# EAGLE schematic main (EAGLE 9.6.2)
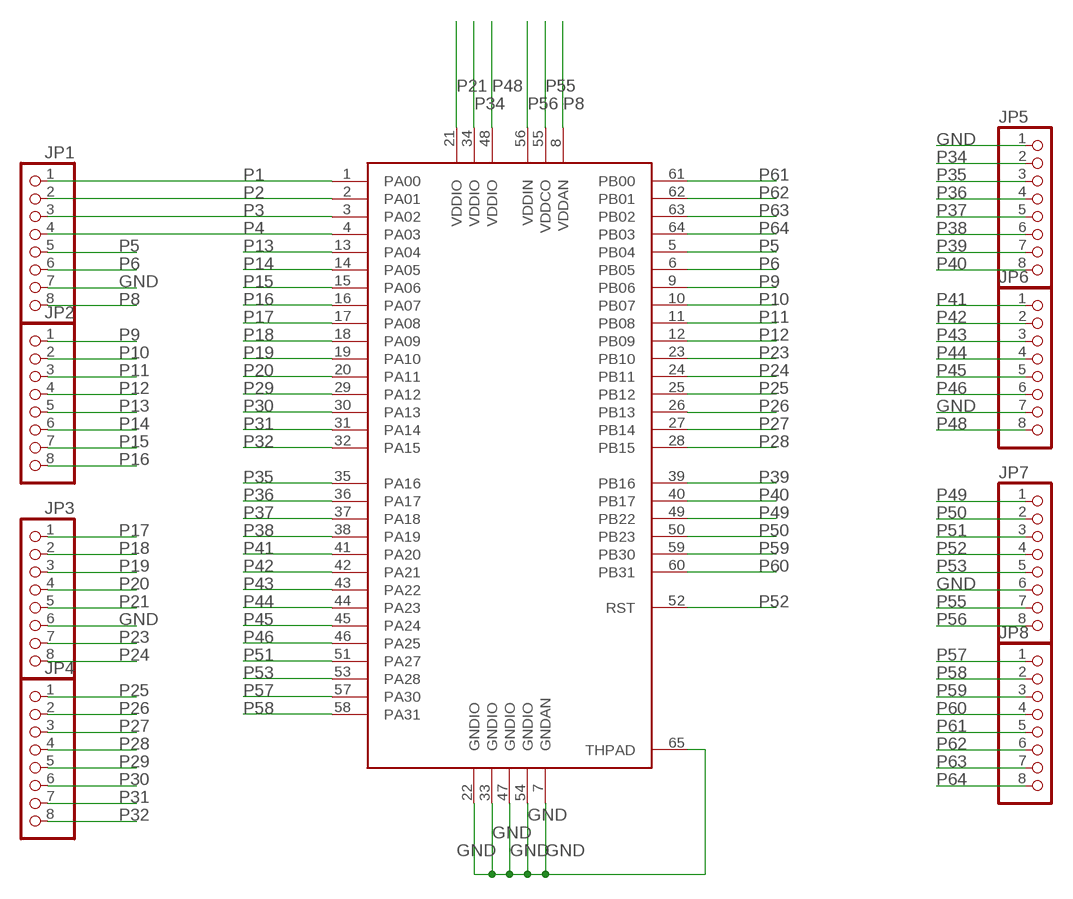
[diagram p0: schematic, sheet 1]

## Parts
JP1  PINHD-1X8CLEANBIG  [1X08-CLEANBIG]
JP2  PINHD-1X8CLEANBIG  [1X08-CLEANBIG]
JP3  PINHD-1X8CLEANBIG  [1X08-CLEANBIG]
JP4  PINHD-1X8CLEANBIG  [1X08-CLEANBIG]
JP5  PINHD-1X8CLEANBIG  [1X08-CLEANBIG]
JP6  PINHD-1X8CLEANBIG  [1X08-CLEANBIG]
JP7  PINHD-1X8CLEANBIG  [1X08-CLEANBIG]
JP8  PINHD-1X8CLEANBIG  [1X08-CLEANBIG]
U$1  ATSAMD21J18AQFN64  [QFN50P900X900X100-65T535]

## Nets
GND: JP1.7 JP3.6 JP5.1 JP6.7 JP7.6 U$1.7(GNDAN) U$1.22(GNDIO) U$1.33(GNDIO) U$1.47(GNDIO) U$1.54(GNDIO) U$1.65(THPAD)
P1: JP1.1 U$1.1(PA00)
P2: JP1.2 U$1.2(PA01)
P3: JP1.3 U$1.3(PA02)
P4: JP1.4 U$1.4(PA03)
P5: JP1.5 U$1.5(PB04)
P6: JP1.6 U$1.6(PB05)
P8: JP1.8 U$1.8(VDDAN)
P9: JP2.1 U$1.9(PB06)
P10: JP2.2 U$1.10(PB07)
P11: JP2.3 U$1.11(PB08)
P12: JP2.4 U$1.12(PB09)
P13: JP2.5 U$1.13(PA04)
P14: JP2.6 U$1.14(PA05)
P15: JP2.7 U$1.15(PA06)
P16: JP2.8 U$1.16(PA07)
P17: JP3.1 U$1.17(PA08)
P18: JP3.2 U$1.18(PA09)
P19: JP3.3 U$1.19(PA10)
P20: JP3.4 U$1.20(PA11)
P21: JP3.5 U$1.21(VDDIO)
P23: JP3.7 U$1.23(PB10)
P24: JP3.8 U$1.24(PB11)
P25: JP4.1 U$1.25(PB12)
P26: JP4.2 U$1.26(PB13)
P27: JP4.3 U$1.27(PB14)
P28: JP4.4 U$1.28(PB15)
P29: JP4.5 U$1.29(PA12)
P30: JP4.6 U$1.30(PA13)
P31: JP4.7 U$1.31(PA14)
P32: JP4.8 U$1.32(PA15)
P34: JP5.2 U$1.34(VDDIO)
P35: JP5.3 U$1.35(PA16)
P36: JP5.4 U$1.36(PA17)
P37: JP5.5 U$1.37(PA18)
P38: JP5.6 U$1.38(PA19)
P39: JP5.7 U$1.39(PB16)
P40: JP5.8 U$1.40(PB17)
P41: JP6.1 U$1.41(PA20)
P42: JP6.2 U$1.42(PA21)
P43: JP6.3 U$1.43(PA22)
P44: JP6.4 U$1.44(PA23)
P45: JP6.5 U$1.45(PA24)
P46: JP6.6 U$1.46(PA25)
P48: JP6.8 U$1.48(VDDIO)
P49: JP7.1 U$1.49(PB22)
P50: JP7.2 U$1.50(PB23)
P51: JP7.3 U$1.51(PA27)
P52: JP7.4 U$1.52(RST)
P53: JP7.5 U$1.53(PA28)
P55: JP7.7 U$1.55(VDDCO)
P56: JP7.8 U$1.56(VDDIN)
P57: JP8.1 U$1.57(PA30)
P58: JP8.2 U$1.58(PA31)
P59: JP8.3 U$1.59(PB30)
P60: JP8.4 U$1.60(PB31)
P61: JP8.5 U$1.61(PB00)
P62: JP8.6 U$1.62(PB01)
P63: JP8.7 U$1.63(PB02)
P64: JP8.8 U$1.64(PB03)

## Library data of the parts
JP1-JP8 = larger_pad_header:PINHD-1X8: PIN HEADER
U$1 = atsamd21j18a:ATSAMD21J18A